# EAGLE schematic base3-5pin-interface-SDA-SCL-Switch-on-output-posunute-konektory (EAGLE 7.2.0)
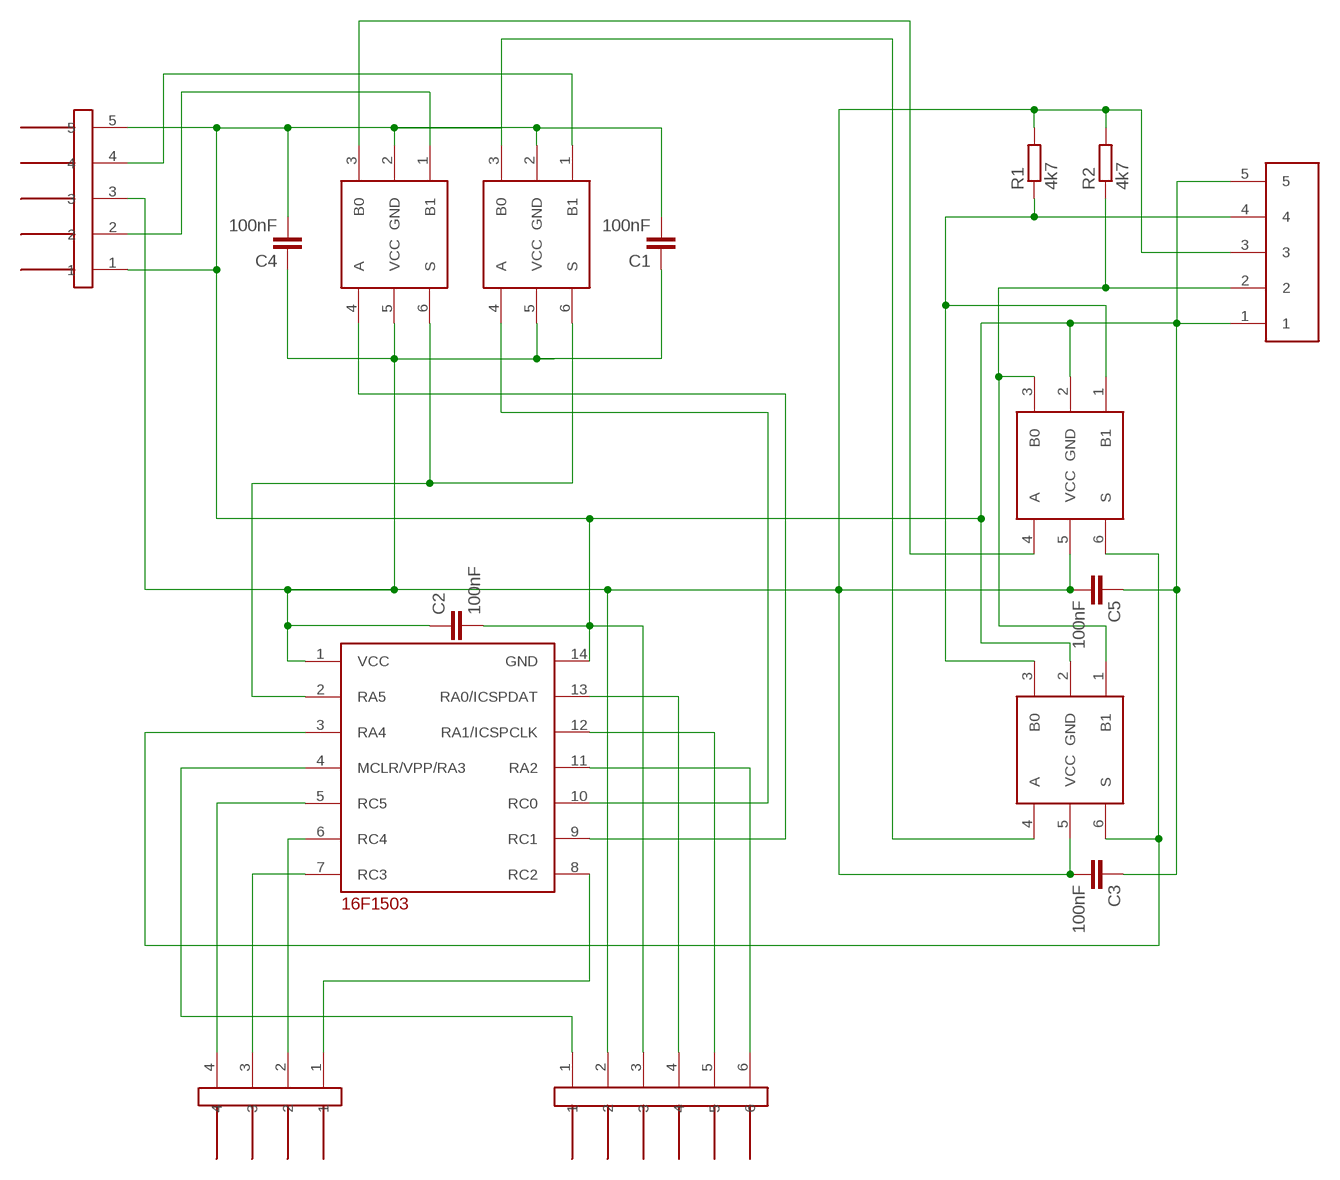
[diagram p0: schematic, sheet 1]

## Parts
C1  100nF  C-EUC0603  [C0603]
C2  100nF  C-EUC0603  [C0603]
C3  100nF  C-EUC0603  [C0603]
C4  100nF  C-EUC0603  [C0603]
C5  100nF  C-EUC0603  [C0603]
R1  4k7  R-EU_M0805  [M0805]
R2  4k7  R-EU_M0805  [M0805]
U$1  16F103-TSSOP  [TSSOP14]
U$2  NC7SB3157P6X  [SC70-6L]
U$3  NC7SB3157P6X  [SC70-6L]
U$4  JUMPER5  [JUMPER5]
U$5  JUMPER5F  [JUMPER5F]
U$6  NC7SB3157P6X  [SC70-6L]
U$7  NC7SB3157P6X  [SC70-6L]
U$8  JUMPER6M  [JUMPER6M]
U$9  JUMPER4M  [JUMPER4M]

## Nets
GND: C1.2 C2.2 C3.1 C4.2 C5.1 U$1.14(GND) U$2.2(GND) U$3.2(GND) U$4.1 U$4.5 U$5.1 U$5.5 U$6.2(GND) U$7.2(GND) U$8.3
N$1: U$1.3(RA4) U$6.6(S) U$7.6(S)
N$2: U$1.10(RC0) U$2.4(A)
N$4: U$1.9(RC1) U$3.4(A)
N$5: U$2.1(B1) U$4.4
N$6: R1.1 U$5.4 U$6.1(B1) U$7.3(B0)
N$7: U$3.3(B0) U$6.4(A)
N$8: U$3.1(B1) U$4.2
N$9: U$1.2(RA5) U$2.6(S) U$3.6(S)
N$10: R2.1 U$5.2 U$6.3(B0) U$7.1(B1)
N$11: U$1.11(RA2) U$8.6
N$12: U$1.5(RC5) U$9.4
N$13: U$1.4(MCLR/VPP/RA3) U$8.1
N$14: U$1.13(RA0/ICSPDAT) U$8.4
N$15: U$1.12(RA1/ICSPCLK) U$8.5
N$16: U$1.7(RC3) U$9.3
N$17: U$1.6(RC4) U$9.2
N$18: U$1.8(RC2) U$9.1
N$20: U$2.3(B0) U$7.4(A)
VCC: C1.1 C2.1 C3.2 C4.1 C5.2 R1.2 R2.2 U$1.1(VCC) U$2.5(VCC) U$3.5(VCC) U$4.3 U$5.3 U$6.5(VCC) U$7.5(VCC) U$8.2

## Library data of the parts
C1-C5 = resistor:C-EU: CAPACITOR, European symbol
R1 R2 = resistor:R-EU_: RESISTOR, European symbol
U$1 = !stavebnice03:16F103-TSSOP
U$2 U$3 U$6 U$7 = !stavebnice03:NC7SB3157P6X
U$4 = !stavebnice03:JUMPER5
U$5 = !stavebnice03:JUMPER5F
U$8 = !stavebnice03:JUMPER6M
U$9 = !stavebnice03:JUMPER4M